# Altium schematic sheet SIM7600G-H.SchDoc
size A4; SheetNumber: 11; SheetTotal: 31
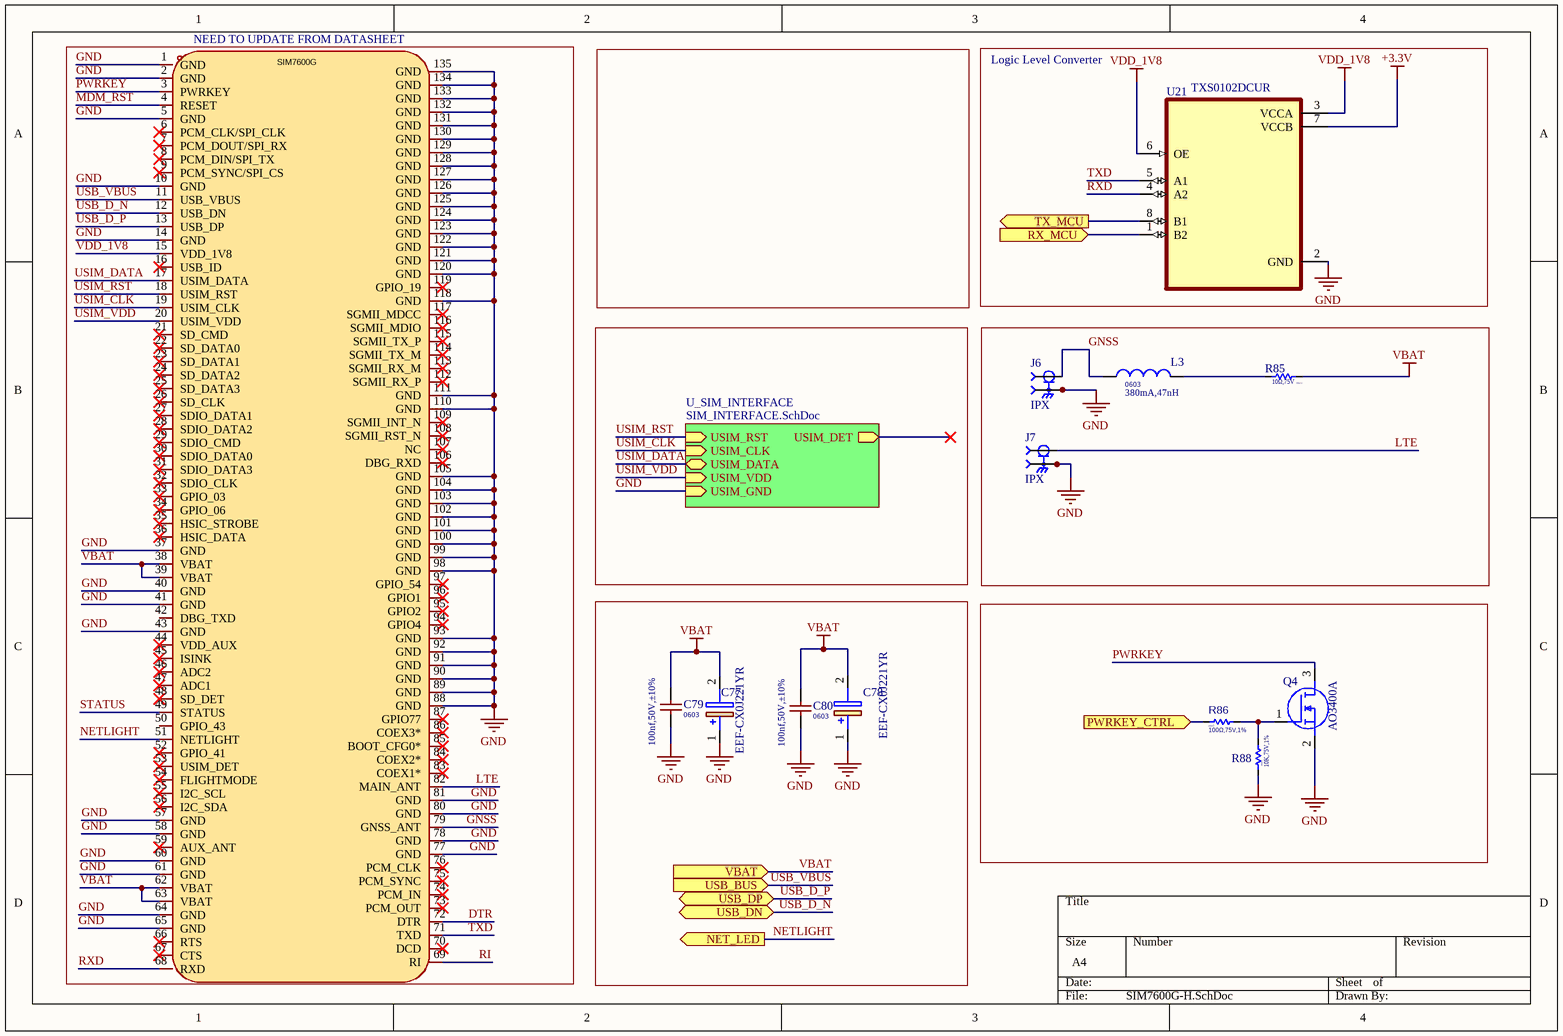
[diagram p0: SIM7600G-H.SchDoc]

## Parts
C77  EEF-CX0J221YR  [CAPPM7343X200N]
C78  EEF-CX0J221YR  [CAPPM7343X200N]
C79  value 100nf,50V,±10%  Package: 0603  [C0603]  (hidden comment: CC0603KRX7R9BB104)
C80  value 100nf,50V,±10%  Package: 0603  [C0603]  (hidden comment: CC0603KRX7R9BB104)
J6  IPX  [IPEX_20279-001E-03]
J7  IPX  [IPEX_20279-001E-03]
L3  value 380mA,47nH  Package: 0603  [LQW18AN47NG00D]  (hidden comment: LQW18AN47NG00D)
Q4  AO3400A  [SOT95P280X125-3N]
R85  value 10Ω,75V  Package: 0603  [R0603]  (hidden comment: 10R)
R86  value 100Ω,75V,1%  Package: 0603  [R0603]  (hidden comment: 100Ω)
R88  Package: 0603  [R0603]  (hidden comment: 10K,75V,1%)
U21  TXS0102DCUR  [8-VSSOP]
U22  SIM7600G  [SMD,30x30mm]

## Blocks framed on the sheet
NEED TO UPDATE FROM DATASHEET: U22
Logic Level Converter: U21

## Sub-sheets
U_SIM_INTERFACE = SIM_INTERFACE.SchDoc: USIM_RST (in), USIM_CLK (in), USIM_DATA (bidir), USIM_DET (out), USIM_VDD (in), USIM_GND (in)

## Ports
NET_LED (out), PWRKEY_CTRL (in), RX_MCU (in), TX_MCU (out), USB_BUS (in), USB_DN (bidir), USB_DP (bidir), VBAT (in)

## Nets
+3.3V: U21.7(VCCB)
GND: C77.1(+) C78.1(+) C79.1 C80.1 J6.2(GND) J6.3(GND) J7.2(GND) J7.3(GND) Q4.2(S) R88.1 U21.2(GND) U22.1(GND) U22.2(GND) U22.5(GND) U22.10(GND) U22.14(GND) U22.37(GND) U22.40(GND) U22.41(GND) U22.43(GND) U22.57(GND) U22.58(GND) U22.60(GND) U22.61(GND) U22.64(GND) U22.65(GND) U22.77(GND) U22.78(GND) U22.80(GND) U22.81(GND) U22.88(GND) U22.89(GND) U22.90(GND) U22.91(GND) U22.92(GND) U22.93(GND) U22.98(GND) U22.99(GND) U22.100(GND) U22.101(GND) U22.102(GND) U22.103(GND) U22.104(GND) U22.105(GND) U22.110(GND) U22.111(GND) U22.118(GND) U22.120(GND) U22.121(GND) U22.122(GND) U22.123(GND) U22.124(GND) U22.125(GND) U22.126(GND) U22.127(GND) U22.128(GND) U22.129(GND) U22.130(GND) U22.131(GND) U22.132(GND) U22.133(GND) U22.134(GND) U22.135(GND) ; sheet U_SIM_INTERFACE/USIM_GND
VBAT: C77.2(-) C78.2(-) C79.2 C80.2 R85.2 U22.38(VBAT) U22.39(VBAT) U22.62(VBAT) U22.63(VBAT) ; port VBAT
VDD_1V8: U21.3(VCCA) U21.6(OE) U22.15(VDD_1V8)
DTR: U22.72(DTR)
GNSS: J6.1(SIG) L3.1 U22.79(GNSS_ANT)
LTE: J7.1(SIG) U22.82(MAIN_ANT)
MDM_RST: U22.4(RESET)
NETLIGHT: U22.51(NETLIGHT) ; port NET_LED
PWRKEY: Q4.3(D) U22.3(PWRKEY)
PWRKEY_CTRL: R86.1 ; port PWRKEY_CTRL
RI: U22.69(RI)
RX_MCU: U21.1(B2) ; port RX_MCU
RXD: U21.4(A2) U22.68(RXD)
STATUS: U22.49(STATUS)
TX_MCU: U21.8(B1) ; port TX_MCU
TXD: U21.5(A1) U22.71(TXD)
USB_D_N: U22.12(USB_DN) ; port USB_DN
USB_D_P: U22.13(USB_DP) ; port USB_DP
USB_VBUS: U22.11(USB_VBUS) ; port USB_BUS
USIM_CLK: U22.19(USIM_CLK) ; sheet U_SIM_INTERFACE/USIM_CLK
USIM_DATA: U22.17(USIM_DATA) ; sheet U_SIM_INTERFACE/USIM_DATA
USIM_RST: U22.18(USIM_RST) ; sheet U_SIM_INTERFACE/USIM_RST
USIM_VDD: U22.20(USIM_VDD) ; sheet U_SIM_INTERFACE/USIM_VDD
NetL3_2: L3.2 R85.1
NetQ4_1: Q4.1(G) R86.2 R88.2

Not connected (* = marked no-connect by the designer): U22 6(PCM_CLK/SPI_CLK)* 7(PCM_DOUT/SPI_RX)* 8(PCM_DIN/SPI_TX)* 9(PCM_SYNC/SPI_CS)* 16(USB_ID)* 21(SD_CMD)* 22(SD_DATA0)* 23(SD_DATA1)* 24(SD_DATA2)* 25(SD_DATA3)* 26(SD_CLK)* 27(SDIO_DATA1)* 28(SDIO_DATA2)* 29(SDIO_CMD)* 30(SDIO_DATA0)* 31(SDIO_DATA3)* 32(SDIO_CLK)* 33(GPIO_03)* 34(GPIO_06)* 35(HSIC_STROBE)* 36(HSIC_DATA)* 42(DBG_TXD) 44(VDD_AUX)* 45(ISINK)* 46(ADC2)* 47(ADC1)* 48(SD_DET)* 50(GPIO_43) 52(GPIO_41)* 53(USIM_DET)* 54(FLIGHTMODE)* 55(I2C_SCL)* 56(I2C_SDA)* 59(AUX_ANT)* 66(RTS)* 67(CTS)* 70(DCD)* 73(PCM_OUT)* 74(PCM_IN)* 75(PCM_SYNC)* 76(PCM_CLK)* 83(COEX1*)* 84(COEX2*)* 85(BOOT_CFG0*)* 86(COEX3*)* 87(GPIO77)* 94(GPIO4)* 95(GPIO2)* 96(GPIO1)* 97(GPIO_54)* 106(DBG_RXD)* 107(NC)* 108(SGMII_RST_N)* 109(SGMII_INT_N)* 112(SGMII_RX_P)* 113(SGMII_RX_M)* 114(SGMII_TX_M)* 115(SGMII_TX_P)* 116(SGMII_MDIO)* 117(SGMII_MDCC)* 119(GPIO_19)*

## Library data of the parts
C77 C78 = EEF-CX0J221YR: Capacitor Polarised; Manufacturer_Name: Panasonic; Datasheet Link: https://datasheet.lcsc.com/szlcsc/PANASONIC-EEFCX0J221YR_C141444.pdf; Height: 2mm; Manufacturer_Part_Number: EEF-CX0J221YR; Mouser Part Number: N/A; Mouser Price/Stock: https://www.mouser.com/Search/Refine.aspx?Keyword=N%2FA
C79 C80 = CC0603KRX7R9BB104: 50V 100nF X7R ±10% 0603 Multilayer Ceramic Capacitors MLCC - SMD/SMT ROHS; MPN: 603-CC603KRX7R9BB104; Manufacturer: KEMET; Max Operating Temp: 35 °C; Min Operating Temp: 15 °C; Datasheet: http://componentsearchengine.com/Datasheets/3/CC0603KRX7R9BB104.pdf; LCSC: C14663
J6 J7 = 20279-001E-03: Small form factor with big performance through 6 GHz; Manufacturer: I-PEX; Package Reference: None; Value: *; MPN: 20279-001E-03; LCSC: C3173448
L3 = LQW18AN47NG00D: 47 nH Unshielded Drum Core, Wirewound Inductor 380 mA 290mOhm Max 0603 (1608 Metric); Manufacturer: Murata Electronics; MPN: LQW18AN47NG00D; Datasheet: https://search.murata.co.jp/Ceramy/image/img/P02/JELF243A-0024.pdf; LCSC: C98076
Q4 = AO3400A: MOSFET (N-Channel); Manufacturer_Name: Alpha & Omega Semiconductors; Datasheet Link: http://aosmd.com/res/data_sheets/AO3400A.pdf; Height: 1.25mm; Manufacturer_Part_Number: AO3400A; Arrow Part Number: AO3400A; Arrow Price/Stock: https://www.arrow.com/en/products/ao3400a/alpha-and-omega-semiconductor?region=nac
R85 = QR0603J10R0P05Z: 100mW Thick Film Resistors 75V ±5% ±100ppm/℃ -55℃~+155℃ 10Ω 0603 Chip Resistor - Surface Mount ROHS; Manufacturer: Ever Ohms Tech; Datasheet: https://datasheet.lcsc.com/lcsc/2304140030_Ever-Ohms-Tech-QR0603J10R0P05Z_C176153.pdf; LCSC: C176153; MPN: QR0603J10R0P05Z
R86 = AC0603FR-13100RL: 100mW Thick Film Resistors 75V ±100ppm/℃ ±1% 100Ω 0603 Chip Resistor - Surface Mount ROHS; Manufacturer: YAGEO(国巨); Min Operating Temp: -55; Max Operating Temp: +155; Type: *; MPN: AC0603FR-13100RL; Datasheet: https://datasheet.lcsc.com/lcsc/2201180400_YAGEO-AC0603FR-13100RL_C1512172.pdf; LCSC: C1512172
R88 = 0603WAF1002T5E: 100mW Thick Film Resistors ±100ppm/℃ ±1% 10kΩ 0603 Chip Resistor - Surface Mount ROHS; Manufacturer: UNI-ROYAL(Uniroyal Elec); Max Operating Temp: 155℃; Min Operating Temp: -55℃; MPN: 0603WAF1002T5E; Datasheet: https://datasheet.lcsc.com/szlcsc/Uniroyal-Elec-0603WAF1002T5E_C25804.pdf; LCSC: C25804; Value: 10K,75V,1%
U21 = TXS0102DCUR: 2-Bit Bidirectional Voltage-Level Shifter for Open-Drain and Push-Pull Application 8-VSSOP -40 to 85; Manufacturer: Texas Instruments; Value: 2 Channel 24Mbps; MPN: TXS0102DCUR; Datasheet: https://www.ti.com/general/docs/suppproductinfo.tsp?distId=10&gotoUrl=https%3A%2F%2Fwww.ti.com%2Flit%2Fgpn%2Ftxs0102; LCSC: C53434; Package: VSSOP-8 Texas Instruments
U22 = SIM7600G: SMD,30x30mm 2G/3G/4G/5G Modules ROHS; Manufacturer: SIMCOM; LCSC: C5354753; MPN: SIM7600G; Package: SMD,30x30mm; Datasheet: https://atta.szlcsc.com/upload/public/pdf/source/20231229/240E3B9F5EAC246FE328D39ABFB18210.pdf